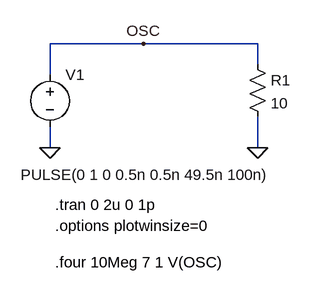
[diagram p0: schematic harmonic_06_trapezoidal_wave.asc]
harmonic_06_trapezoidal_wave.asc, the LTspice schematic file:
Version 4
SHEET 1 880 680
WIRE 176 64 32 64
WIRE 352 64 176 64
WIRE 352 96 352 64
WIRE 32 112 32 64
WIRE 32 224 32 192
WIRE 352 224 352 176
FLAG 32 224 0
FLAG 352 224 0
FLAG 176 64 OSC
SYMBOL voltage 32 96 R0
WINDOW 3 -45 170 Left 2
WINDOW 123 0 0 Left 0
WINDOW 39 0 0 Left 0
SYMATTR Value PULSE(0 1 0 0.5n 0.5n 49.5n 100n)
SYMATTR InstName V1
SYMBOL res 336 80 R0
SYMATTR InstName R1
SYMATTR Value 10
TEXT 40 312 Left 2 !.tran 0 2u 0 1p
TEXT 40 344 Left 2 !.options plotwinsize=0
TEXT 40 400 Left 2 !.four 10Meg 7 1 V(OSC)

The netlist it stands for:
* harmonic_06_trapezoidal_wave.asc
V1 OSC 0 PULSE(0 1 0 0.5n 0.5n 49.5n 100n)
R1 OSC 0 10
.tran 0 2u 0 1p
.options plotwinsize=0
.four 10Meg 7 1 V(OSC)
.backanno
.end